# EAGLE design Iridium_Beacon_Radio_Board (EAGLE 9.1.3)
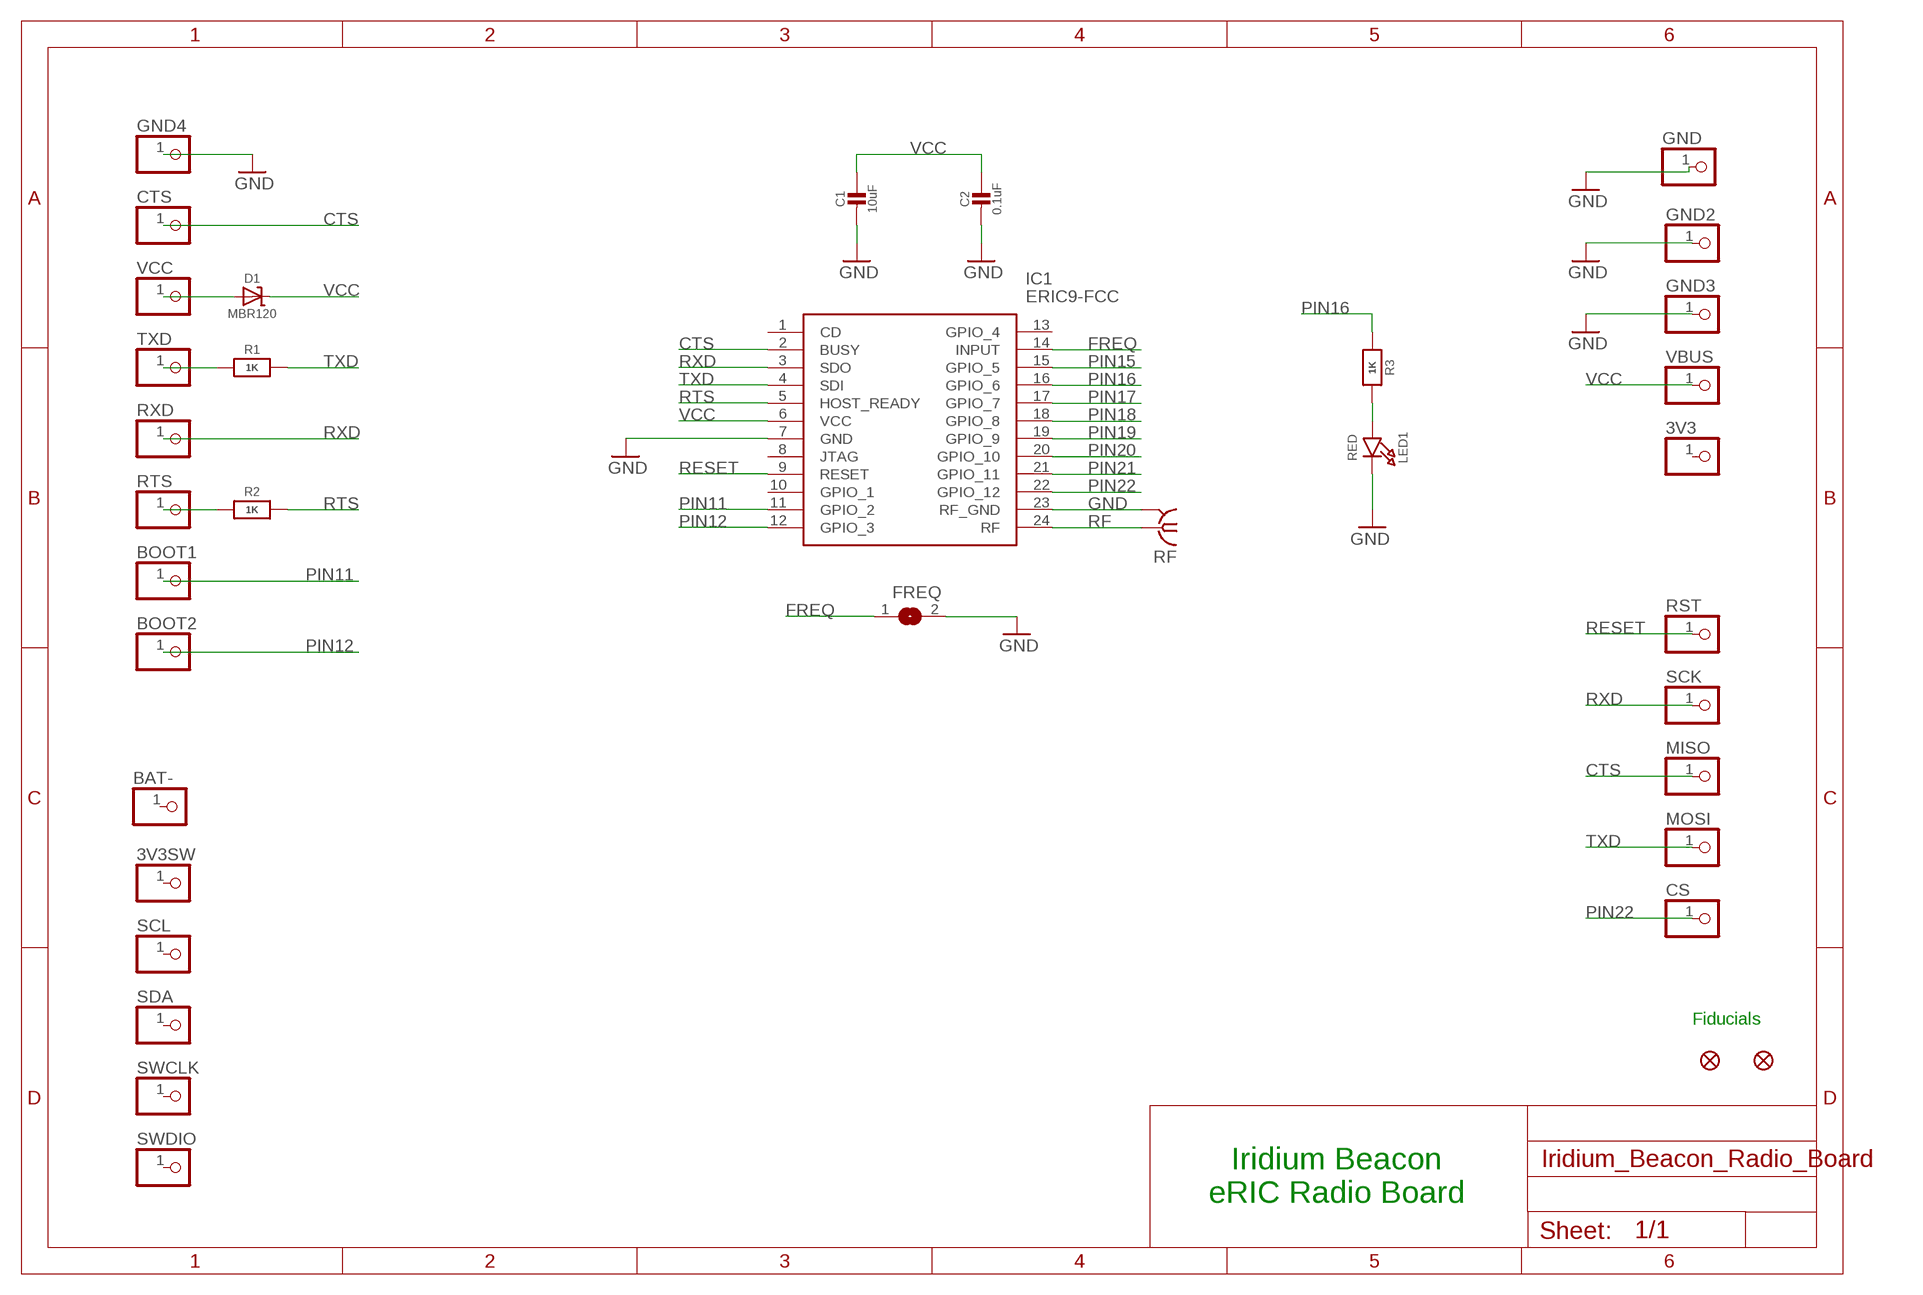
[diagram p0: schematic, sheet 1]

## Parts
3V3  PINHD-1X1  [1X01]
3V3SW  PINHD-1X1  [1X01]
BAT-  PINHD-1X1  [1X01]
BOOT1  PINHD-1X1  [1X01]
BOOT2  PINHD-1X1  [1X01]
C1  10uF  CAP_CERAMIC0805-NOOUTLINE  [0805-NO]
C2  0.1uF  CAP_CERAMIC0603_NO  [0603-NO]
CS  PINHD-1X1  [1X01]
CTS  PINHD-1X1  [1X01]
D1  MBR120  DIODE-SCHOTTKYSOD-123  [SOD-123]
FD1  FIDUCIAL1X2  [FIDUCIAL-1X2]
FD2  FIDUCIAL1X2  [FIDUCIAL-1X2]
FREQ  SOLDERJUMPER  [SOLDERJUMPER_ARROW_NOPASTE]
GND  PINHD-1X1  [1X01]
GND2  PINHD-1X1  [1X01]
GND3  PINHD-1X1  [1X01]
GND4  PINHD-1X1  [1X01]
IC1  ERIC9-FCC  [ERIC4]
LED1  RED  LED0805_NOOUTLINE  [CHIPLED_0805_NOOUTLINE]
MISO  PINHD-1X1  [1X01]
MOSI  PINHD-1X1  [1X01]
R1  1K  RESISTOR_0603_NOOUT  [0603-NO]
R2  1K  RESISTOR_0603_NOOUT  [0603-NO]
R3  1K  RESISTOR_0603_NOOUT  [0603-NO]
RF  SMA-142-0711-821/826  [J502-ND-142-0711-821/826]
RST  PINHD-1X1  [1X01]
RTS  PINHD-1X1  [1X01]
RXD  PINHD-1X1  [1X01]
SCK  PINHD-1X1  [1X01]
SCL  PINHD-1X1  [1X01]
SDA  PINHD-1X1  [1X01]
SWCLK  PINHD-1X1  [1X01]
SWDIO  PINHD-1X1  [1X01]
TXD  PINHD-1X1  [1X01]
VBUS  PINHD-1X1  [1X01]
VCC  PINHD-1X1  [1X01]

## Nets
CTS: CTS.1 IC1.2(BUSY) MISO.1
FREQ: FREQ.1 IC1.14(INPUT)
GND: C1.2 C2.2 FREQ.2 GND2.1 GND3.1 GND4.1 GND.1 IC1.7(GND) IC1.23(RF_GND) LED1.C RF.G@1 RF.G@2 RF.G@3 RF.G@4
N$2: LED1.A R3.2
N$5: R1.1 TXD.1
N$7: R2.1 RTS.1
N$9: D1.A VCC.1
PIN11: BOOT1.1 IC1.11(GPIO_2)
PIN12: BOOT2.1 IC1.12(GPIO_3)
PIN15: IC1.15(GPIO_5)
PIN16: IC1.16(GPIO_6) R3.1
PIN17: IC1.17(GPIO_7)
PIN18: IC1.18(GPIO_8)
PIN19: IC1.19(GPIO_9)
PIN20: IC1.20(GPIO_10)
PIN21: IC1.21(GPIO_11)
PIN22: CS.1 IC1.22(GPIO_12)
RESET: IC1.9(RESET) RST.1
RF: IC1.24(RF) RF.1
RTS: IC1.5(HOST_READY) R2.2
RXD: IC1.3(SDO) RXD.1 SCK.1
TXD: IC1.4(SDI) MOSI.1 R1.2
VCC: C1.1 C2.1 D1.C IC1.6(VCC) VBUS.1
Unconnected: 3V3.1 3V3SW.1 BAT-.1 IC1.1(CD) IC1.8(JTAG) IC1.10(GPIO_1) IC1.13(GPIO_4) SCL.1 SDA.1 SWCLK.1 SWDIO.1

## Notes on the sheet
- Fiducials
- Iridium Beacon
  eRIC Radio Board

## Library data of the parts
3V3 3V3SW BAT- BOOT1 BOOT2 CS CTS GND GND2-GND4 MISO MOSI RST RTS RXD SCK SCL SDA SWCLK SWDIO TXD VBUS VCC = adafruit:PINHD-1X1: Pin header 1x1 for 0.1" spacing With round pins
C1 C2 = microbuilder:CAP_CERAMIC: Ceramic Capacitors For new designs, use the packages preceded by an '_' character since they are more reliable: The following footprints should be used on most boards: _0402 - Standard footprint for regular board layouts _0603 - Standard footprint for regular board layouts _0805 - Standard footprint for regular board layouts _1206 - Standard footprint for regular board layouts For extremely tight-pitch boards where space is at a premium, the following 'micro-pitch' footprints can be used (smaller pads, no silkscreen outline, etc.): _0402MP - Micro-pitch footprint for very dense/compact boards _0603MP - Micro-pitch footprint for very dense/compact boards _0805MP - Micro-pitch footprint for very dense/compact boards _1206MP - Micro-pitch footprint for very dense/compact boards
D1 = microbuilder:DIODE-SCHOTTKY
FD1 FD2 = SparkFun-Aesthetics:FIDUCIAL: Fiducial Alignment Points Various fiducial points for machine vision alignment.
FREQ = microbuilder:SOLDERJUMPER: SMD Solder JUMPER Solder the two pads together to create a connection, or remove the solder to break it. REFLOW - Use this footprint for solder paste and reflow ovens. WAVE - Use this footprint for hand-soldering (larger pads). CLOSED - Has a trace between the two pads to ensure it is closed by default. The trace needs to be cut to disable the jumper, and can be closed again by creating a solder bridge between the two pads.; BOM: EXCLUDE
IC1 = SamacSys_Parts:ERIC9-FCC: RF Modules Euro/US 868/915MHz Int Cont Trans RFMod Source: Datasheet <https://componentsearchengine.com/Datasheets/1/eRIC9-FCC.pdf>; ARROW_PART_NUMBER: eRIC9-FCC; DESCRIPTION: RF Modules Euro/US 868/915MHz Int Cont Trans RFMod; HEIGHT: mm; MANUFACTURER_NAME: LPRS; MANUFACTURER_PART_NUMBER: eRIC9-FCC
LED1 = microbuilder:LED: LED 0603 - 0603 Surface Mount Package 2mA: Green LED - Low Power (3.9mcd, 2ma, 1.7Vf) - Digikey: 475-2709-2-ND Orange LED - Low Power (9.8mcd, 2ma, 1.8Vf) - Digikey: 475-1194-2-ND Red LED - Low Power (5mcd, 2ma, 1.8Vf) - Digikey: 475-1195-2-ND Yellow LED - Low Power (7mcd, 2ma, 1.8Vf) - Digikey: 475-1196-2-ND 5mA: Blue LED - Low Power (17mcd, 5ma, 2.9Vf) - Digikey: LNJ937W8CRACT-ND 0805 - 0805 Surface Mount Package 2mA: Red LED (8.8mcd, 2mA, 1.8Vf, Clear) - Low Power [Digikey: 475-2510-1-ND] Green LED (5mcd, 2mA, 1.8Vf, Clear) - Low Power [Digikey: 475-2730-1-ND] Yellow LED (11.3mcd, 2mA, 1.8Vf, Clear) - Low Power [Digikey: 475-2555-1-ND] 20mA: Red LED (104mcd, 20mA, Diffused) - LS R976 [Digikey: 475-1278-6-ND] Red LED (12mcd, 20mA, 2.0Vf, Clear) - APT2012EC [Digikey: 754-1128-1-ND] Green LED (15mcd, 20mA, 2.2Vf, Clear) - APT2012GC [Digikey: 754-1131-1-ND] Orange LED (160mcd, 20mA, 2.1Vf, Clear) - APT2012SECK [Digikey: 754-1130-1-ND] 1206 - 1206 Surface Mount Package Green LED (26mcd, 20mA, Diffused) - LG N971 [Digikey: 475-1407-6-ND] Red LED (15mcd, 20mA, Diffused) - LH N974 [Digikey: 475-1416-6-ND] Cree - Cree High-Power Surface Mount LEDs XPEBWT-L1-0000-00D50 - White 111lm 350mA 2.9Vf 6200K 110° XTEAWT-00-0000-00000LEE3 - White 114lm 350mA 2.85Vf 5000K 115° Everlight - Everlight 45-21 Series Surface Mount LEDs 45-21/QK2C-B2832AC2CB2/2T - Warm White 2000mcd 20mA 3.25Vf 3050K 120° 45-21/LK2C-B38452C4CB2/2T - Nuetral White 2000mcd 20mA 3.25Vf 4150K 120° 45-21/LK2C-B50634C6CB2/2T - Cold White 2200mcd 20mA 3.25Vf 5650K 120° PLCC2 Reverse Mount LS T77K-J1L2-1-0-2-R18-Z - Red 11.25mcd 2mA 1.8Vf 630nm 120° LO T77K-L1M2-24-Z - Orange 19.6mcd 2mA 1.8Vf 606nm 120° LY T77K-K2M1-26-Z - Yellow 15.7mcd 2mA 1.8Vf 587nm 120°
R1-R3 = microbuilder:RESISTOR: Resistors For new designs, use the packages preceded by an '_' character since they are more reliable: The following footprints should be used on most boards: _0402 - Standard footprint for regular board layouts _0603 - Standard footprint for regular board layouts _0805 - Standard footprint for regular board layouts _1206 - Standard footprint for regular board layouts For extremely tight-pitch boards where space is at a premium, the following 'micro-pitch' footprints can be used (smaller pads, no silkscreen outline, etc.): _0402MP - Micro-pitch footprint for very dense/compact boards _0603MP - Micro-pitch footprint for very dense/compact boards _0805MP - Micro-pitch footprint for very dense/compact boards _1206MP - Micro-pitch footprint for very dense/compact boards
RF = con-coax:SMA-: SMA 50 Ohm End Launch Jack Receptacle - Round Contact Johnson Components Source: www.johnsoncomponents.com .. J502-ND.pdf; MF: JOHNSON COMPONENTS; MPN: 142-0711-821; OC_FARNELL: 1019328; OC_NEWARK: 16F3627

## Board
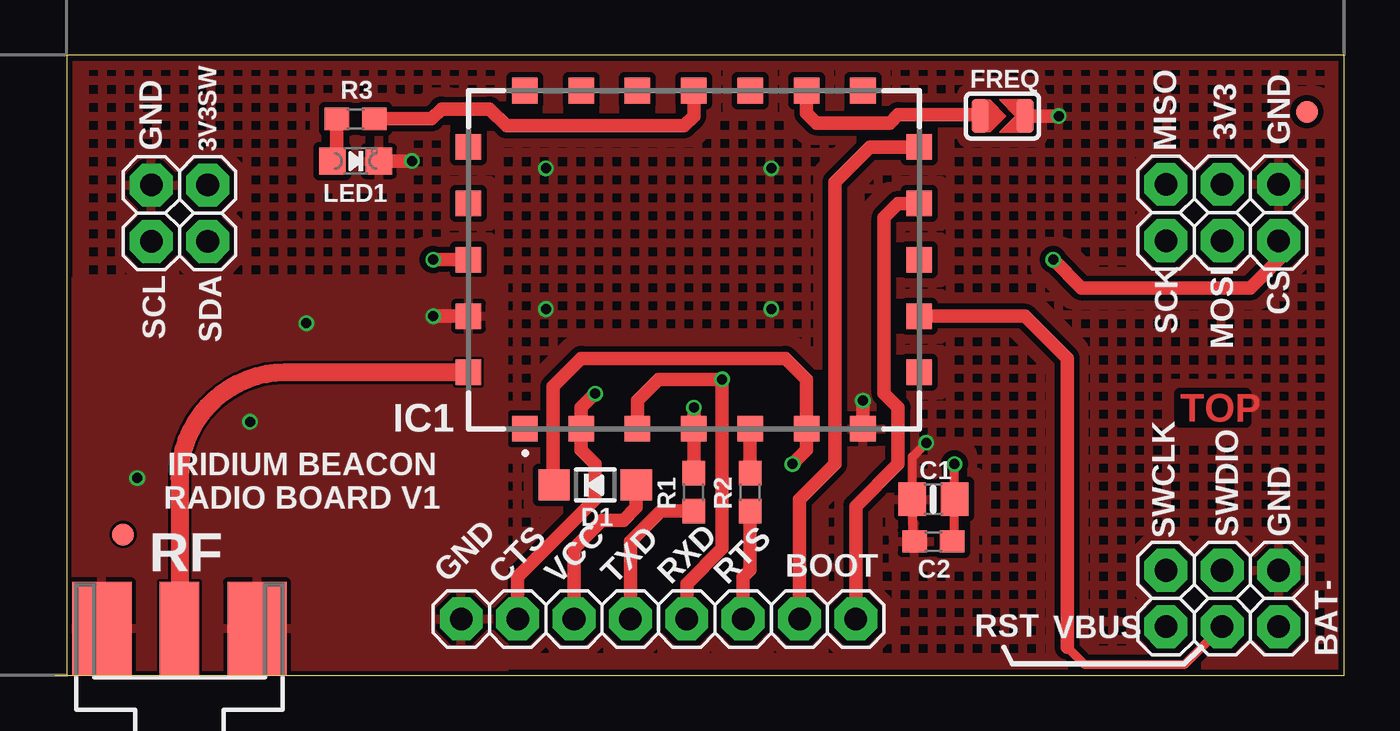
[diagram p1: board, top side]
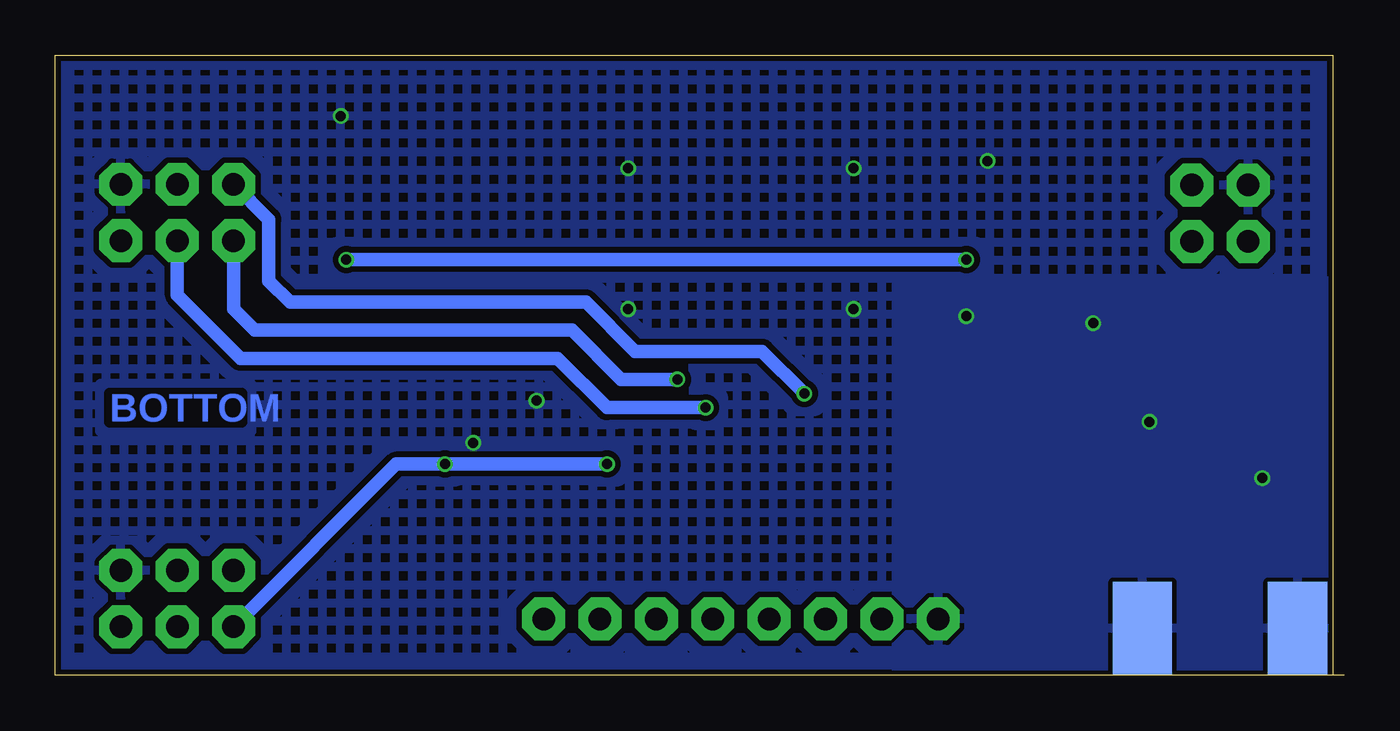
[diagram p2: board, bottom side, seen from below]

Size 57.56 x 27.94 mm. Coordinates in mm from the lower left corner, seen from the top.
Outline: 0,0 57.56,0 57.56,27.94 0,27.94 0,0
Copper layers (1*16): Top 0.018mm / dielectric 1.55mm / Bottom 0.018mm
Design rules "Multi-CB_2L_125um-Tracks_OL35um *": minimum track width 0.125mm, minimum drill 0.2mm, track to track 0.125mm, track to pad 0.125mm, pad to pad 0.125mm, via to via 0.125mm, smd to smd 0mil, copper to edge 0.2mm, drill to drill 0.2mm, minimum pad ring 0.125mm, minimum via ring 0.125mm, stop-mask expansion 2mil, vias tented up to drill 0.45mm, thermal gap 0.2mm

### Footprints (pad centres in the part's own frame; a part is rotated, then mirrored left to right if it is on the bottom)
1X01 = drill 1.016 pad 1.93 octagon: 1 0,0
0805-NO = smd 1.24 x 1.5: 1 -0.95,0; 2 0.95,0
0603-NO = smd 1.1 x 1: 1 -0.85,0; 2 0.85,0
SOD-123 = smd 1.4 x 1.4: A 1.85,0; C -1.85,0
FIDUCIAL-1X2 = smd 1 x 1: 1 0,0
SOLDERJUMPER_ARROW_NOPASTE = smd 0.762 x 1.524: 1 -1.016,0; 2 1.016,0
ERIC4 = smd 1.15 x 1.15: 1 -7.62,-7.62; 2 -5.08,-7.62; 3 -2.54,-7.62; 4 0,-7.62; 5 2.54,-7.62; 6 5.08,-7.62; 7 7.62,-7.62; 8 10.16,-5.08; 9 10.16,-2.54; 10 10.16,0; 11 10.16,2.54; 12 10.16,5.08; 13 7.62,7.62; 14 5.08,7.62; 15 2.54,7.62; 16 0,7.62; 17 -2.54,7.62; 18 -5.08,7.62; 19 -7.62,7.62; 20 -10.16,5.08; 21 -10.16,2.54; 22 -10.16,0; 23 -10.16,-2.54; 24 -10.16,-5.08
CHIPLED_0805_NOOUTLINE = smd 1.2 x 1.2: A 0,-1.05; C 0,1.05
J502-ND-142-0711-821/826 = smd 4.191 x 1.778: 1 2.115,0 | smd 4.191 x 2.667: G@1 2.115,3.495; G@2 2.115,-3.495 | smd 4.191 x 2.667 bottom: G@3 2.115,3.495; G@4 2.115,-3.495

### Placement (x,y rotation side)
3V3  52.07,22.13 270 top
3V3SW  6.35,22.1 90 top
BAT-  54.61,2.19 0 top
BOOT1  35.56,2.54 0 top
BOOT2  33.02,2.54 0 top
C1  39.05,7.94 180 top
C2  39.05,6.03 180 top
CS  54.61,19.59 90 top
CTS  20.32,2.54 0 top
D1  23.81,8.57 0 top
FD1  55.88,25.4 0 top
FD2  2.54,6.35 0 top
FREQ  42.16,25.21 0 top
GND  54.61,4.73 270 top
GND2  54.61,22.13 270 top
GND3  3.81,22.1 90 top
GND4  17.78,2.54 0 top
IC1  28.26,18.73 0 top
LED1  13.02,23.18 270 top
MISO  49.53,22.13 270 top
MOSI  52.07,19.59 90 top
R1  28.26,8.26 90 top
R2  30.8,8.26 90 top
R3  13.02,25.08 180 top
RF  5.08,0 90 top
RST  52.07,2.19 90 top
RTS  30.48,2.54 0 top
RXD  27.94,2.54 0 top
SCK  49.53,19.59 90 top
SCL  3.81,19.56 270 top
SDA  6.35,19.56 270 top
SWCLK  49.53,4.73 90 top
SWDIO  52.07,4.73 90 top
TXD  25.4,2.54 0 top
VBUS  49.53,2.19 90 top
VCC  22.86,2.54 0 top

### Tracks (layer width: path | path; a pad name or v marks a point on that pad's centre or on a via)
CTS  (via drill 0.45)
  Top 0.61: CTS.1 20.32,4.45 23.81,7.94 23.81,9.53 23.18,10.16 IC1.2 23.18,12.06 v23.81,12.7
  Bottom 0.61: v23.81,12.7 25.72,14.61 31.43,14.61 33.66,16.83 46.99,16.83 47.94,17.78 47.94,20.54 MISO.1
FREQ
  Top 0.61: FREQ.1 41.21,25.15 41.08,25.27 37.47,25.27 37.08,24.89 33.78,24.89 33.34,25.34 IC1.14
GND  (via drill 0.45)
  Top 0.406: C2.2 38.1,6.13 38.1,6.35 C1.2 38.1,9.85 v38.73,10.48
  Top 0.61: IC1.7 v35.88,12.38 | IC1.23 v16.51,16.19 | FREQ.2 v44.7,25.21 | LED1.C v15.56,23.18
  other vias: 10.79,15.88 8.26,11.43 3.17,8.89 31.75,22.86 31.75,16.51 21.59,16.51 21.59,22.86
  pour Bottom (isolate 0.254, rank 2, hatched): 0,0 0,27.94 57.56,27.94 57.56,0
  pour Top (isolate 0.254, rank 2, hatched): 0,0 0,27.94 57.56,27.94 57.56,0
  pour Top (isolate 0.102): 0,0 0,17.78 19.68,17.78 19.68,0
  pour Bottom (isolate 0.102): 0,0 0,17.78 19.68,17.78 19.68,0
N$2
  Top 0.61: R3.2 12.17,23.38 arc-90 LED1.A
N$5
  Top 0.61: TXD.1 25.4,6.03 26.77,7.41 R1.1
N$7
  Top 0.61: RTS.1 30.48,4.45 30.8,4.76 R2.1
N$9
  Top 0.61: VCC.1 22.86,5.71 24.13,6.99 25.08,6.99 25.66,7.57 D1.A
PIN11
  Top 0.61: BOOT1.1 35.56,7.62 37.47,9.53 37.47,12.06 36.83,12.7 36.83,20.64 37.47,21.27 IC1.11
PIN12
  Top 0.61: BOOT2.1 33.02,7.94 34.61,9.53 34.61,22.23 36.2,23.81 IC1.12
PIN16
  Top 0.61: R3.1 16.45,25.08 16.89,25.53 19.05,25.53 19.81,24.77 27.81,24.77 28.26,25.21 IC1.16
PIN22  (via drill 0.45)
  Top 0.61: IC1.22 v16.51,18.73 | v44.45,18.73 45.72,17.46 53.34,17.46 53.66,17.78 54.61,18.73 CS.1
  Bottom 0.61: v16.51,18.73 v44.45,18.73
RESET
  Top 0.406: RST.1 50.35,0.48 45.88,0.48 45.09,1.27
  Top 0.61: 45.09,1.27 45.09,14.29 43.18,16.19 IC1.9
RF
  Top 0.813: IC1.24 9.84,13.65 arc90 5.08,8.89 RF.1
RTS
  Top 0.61: R2.2 IC1.5
RXD  (via drill 0.45)
  Top 0.61: RXD.1 27.94,4.13 29.53,5.71 v29.53,13.34 26.67,13.34 25.72,12.38 IC1.3
  Bottom 0.61: SCK.1 49.53,16.51 48.58,15.56 34.29,15.56 32.07,13.34 v29.53,13.34
TXD  (via drill 0.45)
  Top 0.61: R1.2 IC1.4 v28.26,12.06
  Bottom 0.61: v28.26,12.06 32.7,12.06 34.92,14.29 49.21,14.29 52.07,17.14 MOSI.1
VCC  (via drill 0.45)
  Top 0.406: C2.1 40,6.13 C1.1 v40,9.52 v40.01,9.53
  Top 0.61: D1.C 21.91,8.63 21.91,13.02 23.18,14.29 32.38,14.29 33.34,13.34 IC1.6 33.34,10.16 v32.7,9.53
  Bottom 0.61: v32.7,9.53 v40.01,9.53 42.2,9.53 VBUS.1

### Text on the board
Top: TOP
Bottom: BOTTOM
tPlace: IRIDIUM BEACON / RADIO BOARD V1
tNames: GND | GND | GND | BOOT